# EAGLE design LipoCC (EAGLE 6.5.0)
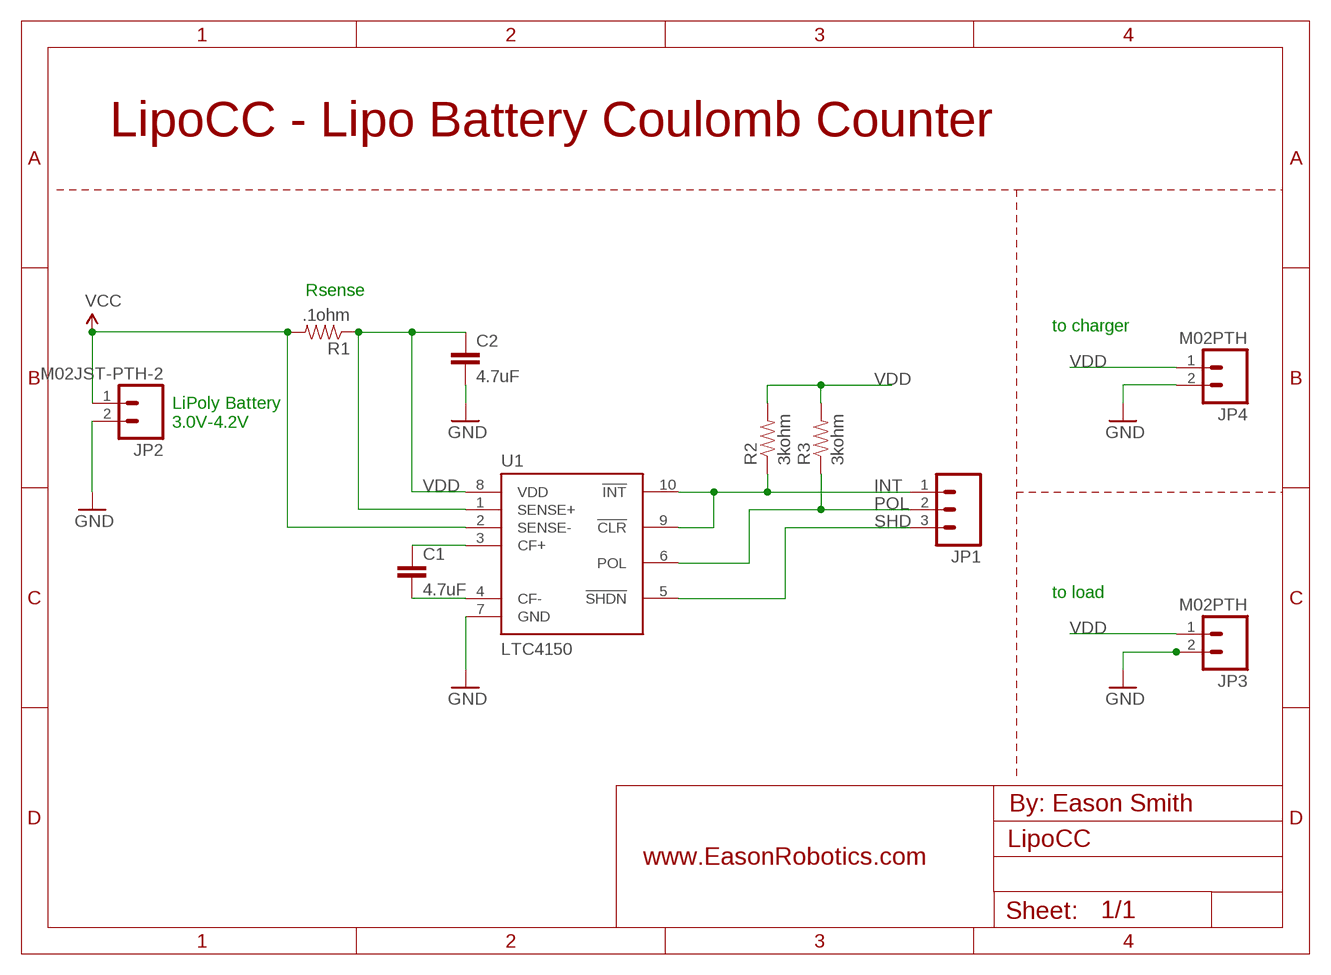
[diagram p0: schematic, sheet 1]

## Parts
C1  4.7uF  4.7UF-6.3V-10%(0603)0603  [0603-CAP]
C2  4.7uF  4.7UF-6.3V-10%(0603)0603  [0603-CAP]
JP1  M03PTH  [1X03]
JP2  M02JST-PTH-2  [JST-2-PTH]
JP3  M02PTH  [1X02]
JP4  M02PTH  [1X02]
R1  .1ohm  RESISTOR0603  [0603-RES]
R2  3kohm  3.3KOHM1/10W1%(0603)  [0603-RES]
R3  3kohm  3.3KOHM1/10W1%(0603)  [0603-RES]
U1  LTC4150  [MSOP10]

## Nets
GND: C2.2 JP2.2 JP3.2 JP4.2 U1.7(GND)
INT: JP1.1 R2.1 U1.9(!CLR!) U1.10(!INT!)
N$1: C1.1 U1.3(CF+)
N$2: C1.2 U1.4(CF-)
POL: JP1.2 R3.1 U1.6(POL)
SHD: JP1.3 U1.5(!SHDN!)
VCC: JP2.1 R1.2 U1.2(SENSE-)
VDD: C2.1 JP3.1 JP4.1 R1.1 R2.2 R3.2 U1.1(SENSE+) U1.8(VDD)

## Notes on the sheet
- LipoCC - Lipo Battery Coulomb Counter
- Rsense
- to charger
- LiPoly Battery
  3.0V-4.2V
- to load
- By: Eason Smith
- www.EasonRobotics.com

## Library data of the parts
C1 C2 = SparkFun-Capacitors:4.7UF-6.3V-10%(0603): CAP-08280; PROD_ID: CAP-08280
JP1 = SparkFun-Connectors:M03: Header 3 Standard 3-pin 0.1" header. Use with straight break away headers (SKU : PRT-00116), right angle break away headers (PRT-00553), swiss pins (PRT-00743), machine pins (PRT-00117), and female headers (PRT-00115). Molex polarized connector foot print use with SKU : PRT-08232 with associated crimp pins and housings.
JP2 = SparkFun-Connectors:M02: Standard 2-pin 0.1" header. Use with - straight break away headers ( PRT-00116) - right angle break away headers (PRT-00553) - swiss pins (PRT-00743) - machine pins (PRT-00117) - female headers (PRT-00115) Molex polarized connector foot print use with: PRT-08233 with associated crimp pins and housings. 2.54_SCREWTERM for use with PRT-10571. 3.5mm Screw Terminal footprints for PRT-08084 5mm Screw Terminal footprints for use with PRT-08432; SKU: PRT-09914
JP3 JP4 = SparkFun-Connectors:M02: Standard 2-pin 0.1" header. Use with - straight break away headers ( PRT-00116) - right angle break away headers (PRT-00553) - swiss pins (PRT-00743) - machine pins (PRT-00117) - female headers (PRT-00115) Molex polarized connector foot print use with: PRT-08233 with associated crimp pins and housings. 2.54_SCREWTERM for use with PRT-10571. 3.5mm Screw Terminal footprints for PRT-08084 5mm Screw Terminal footprints for use with PRT-08432
R1 = SparkFun-Resistors:RESISTOR: Resistor Basic schematic elements and footprints for 0603, 1206, and PTH resistors.
R2 R3 = SparkFun-Resistors:3.3KOHM1/10W1%(0603): RES-07851; PROD_ID: RES-07851
U1 = SparkFun-DigitalIC:LTC4150: LTC4150 Coulomb Counter / Battery Gas Gauge * Indicates Charge Quantity and Polarity * ±50mV Sense Voltage Range * Precision Timer Capacitor or Crystal Not Required * 2.7V to 8.5V Operation * High Side Sense * 32.55Hz/V Charge Count Frequency * 1.5μA Shutdown Current * 10-Pin MSOP Package Manufacturer's page: http://www.linear.com/product/LTC4150

## Board
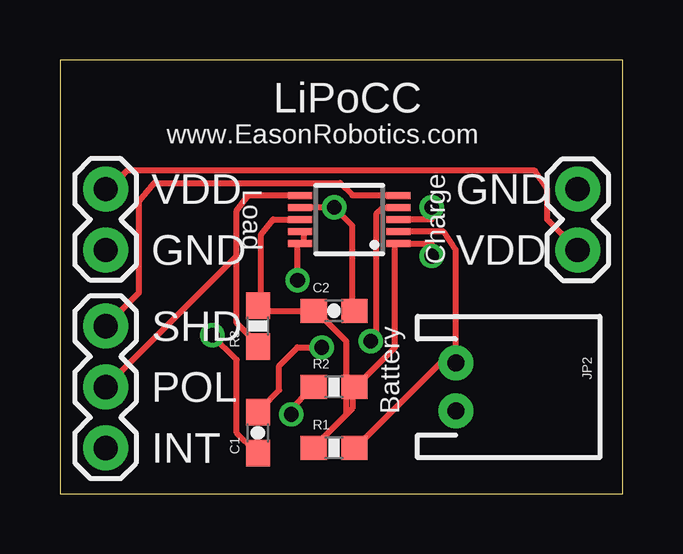
[diagram p1: board, top side]
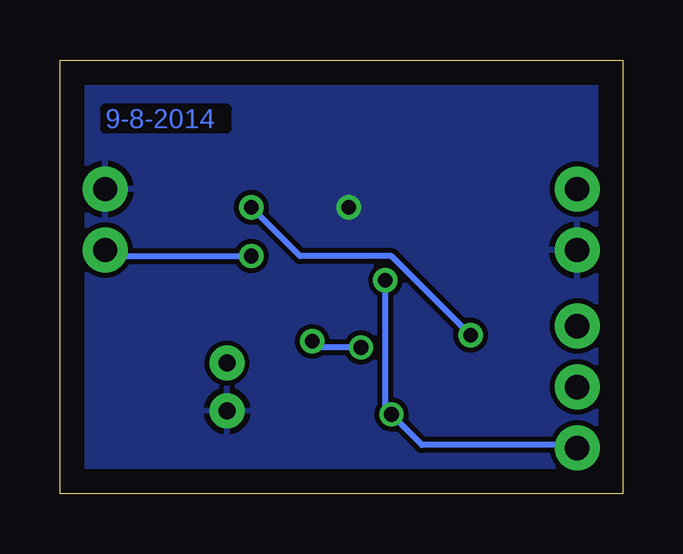
[diagram p2: board, bottom side, seen from below]

Size 23.48 x 18.09 mm. Coordinates in mm from the lower left corner, seen from the top.
Outline: 0,0 23.48,0 23.48,18.09 0,18.09 0,0
Copper layers (1*16): Top 0.035mm / dielectric 1.5mm / Bottom 0.035mm
Design rules "default": minimum track width 10mil, minimum drill 24mil, track to track 8mil, track to pad 8mil, pad to pad 8mil, via to via 8mil, smd to smd 8mil, copper to edge 40mil, drill to drill 8mil, minimum pad ring 10mil, minimum via ring 8mil, stop-mask expansion 4mil, vias tented up to drill 0mil, thermal gap 10mil

### Footprints (pad centres in the part's own frame; a part is rotated, then mirrored left to right if it is on the bottom)
0603-CAP = smd 1.1 x 1: 1 -0.85,0; 2 0.85,0
1X03 = drill 1.016 pad 1.88: 1 0,0; 2 2.54,0; 3 5.08,0
JST-2-PTH = drill 0.7 pad 1.448: 1 -1,0; 2 1,0
1X02 = drill 1.016 pad 1.88: 1 0,0; 2 2.54,0
0603-RES = smd 1.1 x 1: 1 -0.85,0; 2 0.85,0
MSOP10 = smd 0.3 x 1: 1 -1,-2.05; 2 -0.5,-2.05; 3 0,-2.05; 4 0.5,-2.05; 5 1,-2.05; 6 1,2.05; 7 0.5,2.05; 8 0,2.05; 9 -0.5,2.05; 10 -1,2.05

### Placement (x,y rotation side)
C1  8.25,2.54 90 top
C2  11.43,7.62 0 top
JP1  1.91,1.91 90 top
JP2  16.51,4.45 270 top
JP3  21.59,10.16 90 top
JP4  1.91,12.7 270 top
R1  11.43,1.91 0 top
R2  11.43,4.45 0 top
R3  8.25,6.98 90 top
U1  12.06,11.43 90 top

### Tracks (layer width: path | path; a pad name or v marks a point on that pad's centre or on a via)
GND  (via drill 0.61)
  Top 0.254: U1.7 10.16,11.94 v11.43,11.94 12.19,11.18 12.19,7.62 C2.2
  pour Bottom: 0.64,17.78 22.86,17.78 22.86,0.63 0.64,0.63
INT  (via drill 0.61)
  Top 0.254: U1.9 10.16,10.92 10.16,10.41 U1.10 9.91,10.41 v9.91,8.89 | v9.65,3.3 9.65,3.56 10.41,4.32 R2.1
  Bottom 0.254: JP1.1 2.03,2.03 8.38,2.03 v9.65,3.3 9.91,3.3 v9.91,8.89
N$1  (via drill 0.61)
  Top 0.254: U1.3 15.49,11.43 v15.49,11.94 | v6.35,6.6 7.37,5.59 7.37,2.54 8.13,1.78 C1.1
  Bottom 0.254: v15.49,11.94 13.46,9.91 9.65,9.91 v6.35,6.6
N$2  (via drill 0.61)
  Top 0.254: v12.95,6.35 13.21,6.6 13.21,11.68 13.46,11.94 13.97,11.94 U1.4 | v10.92,6.1 9.91,6.1 9.14,5.33 9.14,4.32 8.38,3.56 C1.2
  Bottom 0.254: v12.95,6.35 12.7,6.1 v10.92,6.1
POL
  Top 0.254: 7.37,9.91 7.37,7.11 8.13,6.35 R3.1 | 7.37,9.91 7.37,11.81 7.87,12.45 9.91,12.45 U1.6 | 7.37,9.91 JP1.2
SHD
  Top 0.254: JP1.3 3.3,8.38 3.3,12.19 3.94,12.95 11.68,12.95 12.19,12.45 13.97,12.45 U1.5
VCC
  Top 0.254: 16.51,6.1 JP2.1 16.51,5.59 | 16.51,6.1 16.51,10.16 16,10.92 14.22,10.92 U1.2 | 16.51,6.1 12.45,2.03 R1.2
VDD  (via drill 0.61)
  Top 0.254: U1.8 8.89,11.43 8.38,10.79 8.38,7.87 R3.2 8.38,7.62 C2.1 10.67,7.62 11.94,6.35 11.94,3.3 | 11.94,3.3 12.19,3.56 12.19,4.32 R2.2 12.45,4.57 13.97,6.1 13.97,10.41 U1.1 14.22,10.41 15.49,10.41 v15.49,9.91 | 11.94,3.3 10.67,2.03 R1.1 | JP3.1 20.32,11.43 20.32,12.7 19.81,13.46 2.79,13.46 2.03,12.7 JP4.1
  Bottom 0.254: v15.49,9.91 21.34,9.91 JP3.1

### Text on the board
Bottom: 9-8-2014
tPlace: LiPoCC | www.EasonRobotics.com | Charge | Load | VDD | GND | GND | VDD | SHD | Battery | POL | INT